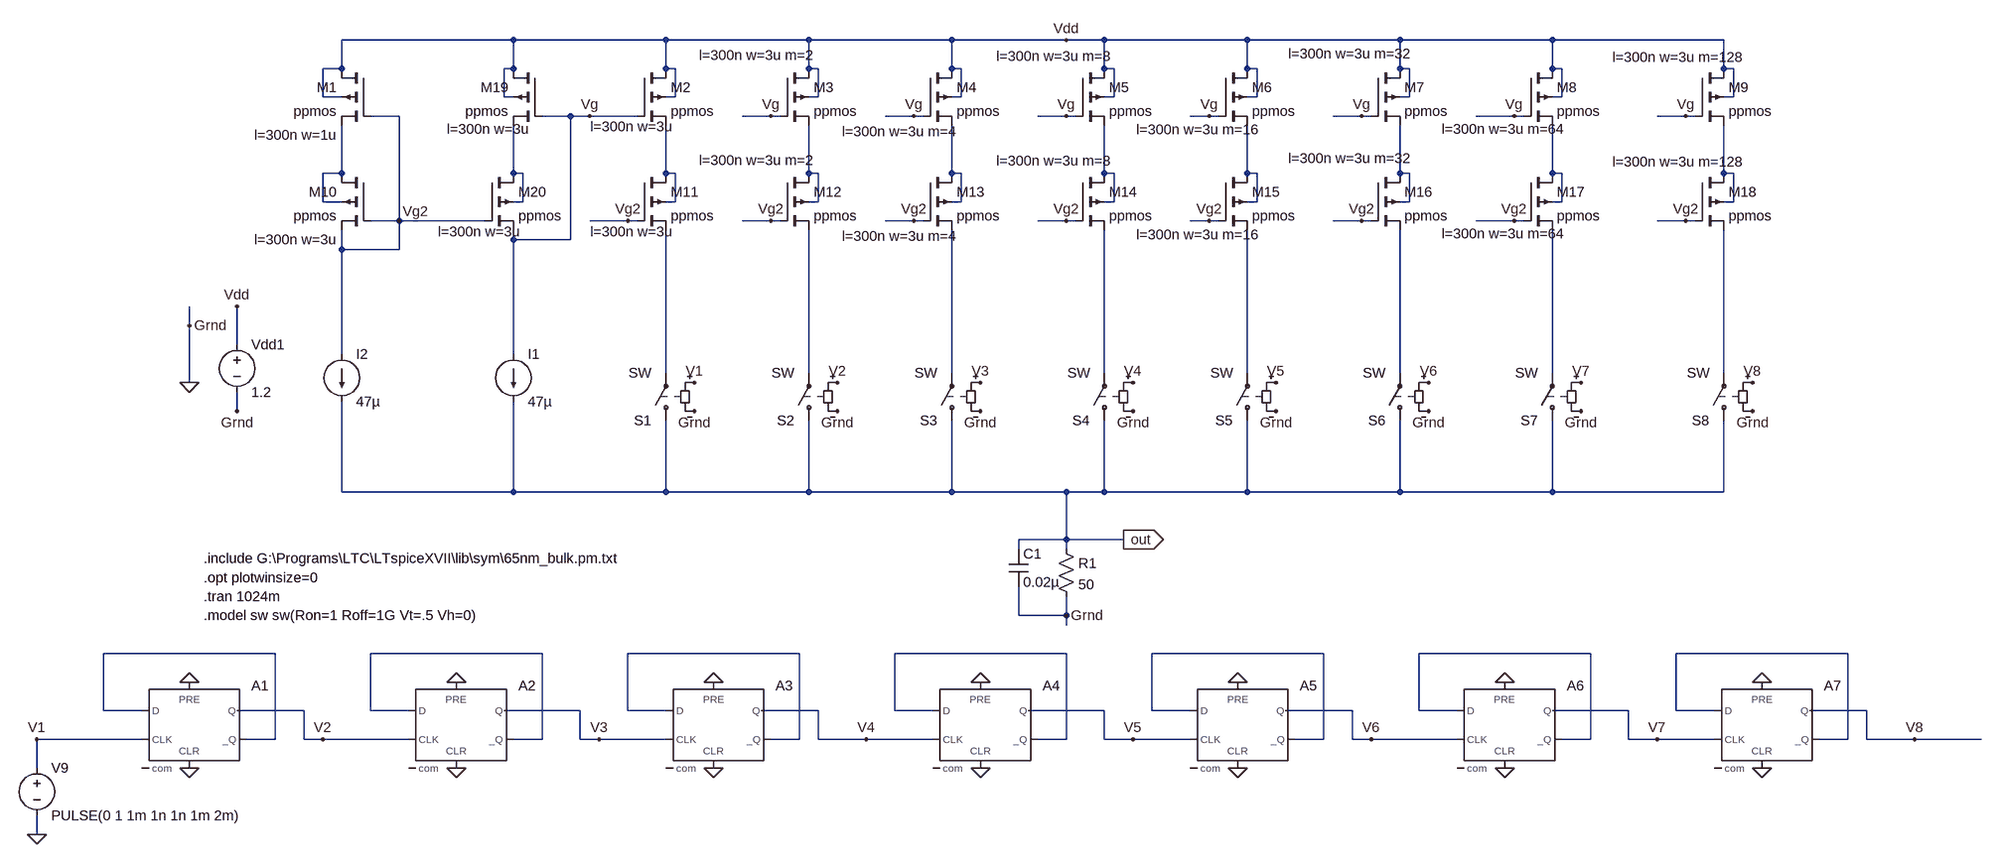
[diagram p0: schematic DAC_lv_sooch_cascode_flip_flop.asc]
DAC_lv_sooch_cascode_flip_flop.asc, the LTspice schematic file:
Version 4
SHEET 1 1952 1300
WIRE -656 -720 -944 -720
WIRE -400 -720 -656 -720
WIRE -160 -720 -400 -720
WIRE 80 -720 -160 -720
WIRE 272 -720 80 -720
WIRE 336 -720 272 -720
WIRE 576 -720 336 -720
WIRE 832 -720 576 -720
WIRE 1088 -720 832 -720
WIRE 1376 -720 1088 -720
WIRE -944 -672 -944 -720
WIRE -944 -672 -976 -672
WIRE -656 -672 -656 -720
WIRE -656 -672 -672 -672
WIRE -400 -672 -400 -720
WIRE -384 -672 -400 -672
WIRE -160 -672 -160 -720
WIRE -144 -672 -160 -672
WIRE 80 -672 80 -720
WIRE 96 -672 80 -672
WIRE 336 -672 336 -720
WIRE 352 -672 336 -672
WIRE 576 -672 576 -720
WIRE 592 -672 576 -672
WIRE 832 -672 832 -720
WIRE 848 -672 832 -672
WIRE 1088 -672 1088 -720
WIRE 1104 -672 1088 -672
WIRE 1376 -672 1376 -720
WIRE 1392 -672 1376 -672
WIRE -976 -624 -976 -672
WIRE -944 -624 -976 -624
WIRE -672 -624 -672 -672
WIRE -656 -624 -672 -624
WIRE -384 -624 -384 -672
WIRE -384 -624 -400 -624
WIRE -144 -624 -144 -672
WIRE -144 -624 -160 -624
WIRE 96 -624 96 -672
WIRE 96 -624 80 -624
WIRE 352 -624 352 -672
WIRE 352 -624 336 -624
WIRE 592 -624 592 -672
WIRE 592 -624 576 -624
WIRE 848 -624 848 -672
WIRE 848 -624 832 -624
WIRE 1104 -624 1104 -672
WIRE 1104 -624 1088 -624
WIRE 1392 -624 1392 -672
WIRE 1392 -624 1376 -624
WIRE -848 -592 -896 -592
WIRE -560 -592 -608 -592
WIRE -528 -592 -560 -592
WIRE -448 -592 -528 -592
WIRE -224 -592 -272 -592
WIRE -208 -592 -224 -592
WIRE 16 -592 -32 -592
WIRE 32 -592 16 -592
WIRE 272 -592 224 -592
WIRE 288 -592 272 -592
WIRE 512 -592 480 -592
WIRE 528 -592 512 -592
WIRE 768 -592 720 -592
WIRE 784 -592 768 -592
WIRE 1024 -592 960 -592
WIRE 1040 -592 1024 -592
WIRE 1312 -592 1264 -592
WIRE 1328 -592 1312 -592
WIRE -944 -496 -944 -576
WIRE -944 -496 -976 -496
WIRE -656 -496 -656 -576
WIRE -640 -496 -656 -496
WIRE -400 -496 -400 -576
WIRE -384 -496 -400 -496
WIRE -160 -496 -160 -576
WIRE -144 -496 -160 -496
WIRE 80 -496 80 -576
WIRE 96 -496 80 -496
WIRE 336 -496 336 -576
WIRE 352 -496 336 -496
WIRE 576 -496 576 -576
WIRE 592 -496 576 -496
WIRE 832 -496 832 -576
WIRE 848 -496 832 -496
WIRE 1088 -496 1088 -576
WIRE 1104 -496 1088 -496
WIRE 1376 -496 1376 -576
WIRE 1392 -496 1376 -496
WIRE -976 -448 -976 -496
WIRE -944 -448 -976 -448
WIRE -640 -448 -640 -496
WIRE -640 -448 -656 -448
WIRE -384 -448 -384 -496
WIRE -384 -448 -400 -448
WIRE -144 -448 -144 -496
WIRE -144 -448 -160 -448
WIRE 96 -448 96 -496
WIRE 96 -448 80 -448
WIRE 352 -448 352 -496
WIRE 352 -448 336 -448
WIRE 592 -448 592 -496
WIRE 592 -448 576 -448
WIRE 848 -448 848 -496
WIRE 848 -448 832 -448
WIRE 1104 -448 1104 -496
WIRE 1104 -448 1088 -448
WIRE 1392 -448 1392 -496
WIRE 1392 -448 1376 -448
WIRE -848 -416 -848 -592
WIRE -848 -416 -896 -416
WIRE -704 -416 -848 -416
WIRE -464 -416 -528 -416
WIRE -448 -416 -464 -416
WIRE -224 -416 -272 -416
WIRE -208 -416 -224 -416
WIRE 16 -416 -32 -416
WIRE 32 -416 16 -416
WIRE 272 -416 224 -416
WIRE 288 -416 272 -416
WIRE 512 -416 480 -416
WIRE 528 -416 512 -416
WIRE 768 -416 720 -416
WIRE 784 -416 768 -416
WIRE 1024 -416 960 -416
WIRE 1040 -416 1024 -416
WIRE 1312 -416 1264 -416
WIRE 1328 -416 1312 -416
WIRE -656 -384 -656 -400
WIRE -560 -384 -560 -592
WIRE -560 -384 -656 -384
WIRE -944 -368 -944 -400
WIRE -848 -368 -848 -416
WIRE -848 -368 -944 -368
WIRE -1200 -240 -1200 -272
WIRE -1120 -208 -1120 -272
WIRE -944 -192 -944 -368
WIRE -656 -192 -656 -384
WIRE -400 -160 -400 -400
WIRE -160 -160 -160 -400
WIRE 80 -160 80 -400
WIRE 336 -160 336 -400
WIRE 576 -160 576 -400
WIRE 832 -160 832 -400
WIRE 1088 -160 1088 -400
WIRE 1376 -160 1376 -400
WIRE -1200 -144 -1200 -240
WIRE -1120 -96 -1120 -128
WIRE -944 48 -944 -112
WIRE -656 48 -656 -112
WIRE -656 48 -944 48
WIRE -400 48 -400 -80
WIRE -400 48 -656 48
WIRE -160 48 -160 -80
WIRE -160 48 -400 48
WIRE 80 48 80 -80
WIRE 80 48 -160 48
WIRE 272 48 80 48
WIRE 336 48 336 -80
WIRE 336 48 272 48
WIRE 576 48 576 -80
WIRE 576 48 336 48
WIRE 832 48 832 -80
WIRE 832 48 576 48
WIRE 1088 48 1088 -80
WIRE 1088 48 832 48
WIRE 1376 48 1376 -80
WIRE 1376 48 1088 48
WIRE 272 128 272 48
WIRE 272 128 192 128
WIRE 368 128 272 128
WIRE 192 144 192 128
WIRE 272 144 272 128
WIRE 192 256 192 208
WIRE 272 256 272 224
WIRE 272 256 192 256
WIRE 272 272 272 256
WIRE -1056 320 -1344 320
WIRE -608 320 -896 320
WIRE -176 320 -464 320
WIRE 272 320 -16 320
WIRE 704 320 416 320
WIRE 1152 320 864 320
WIRE 1584 320 1296 320
WIRE -1344 416 -1344 320
WIRE -1280 416 -1344 416
WIRE -1008 416 -1120 416
WIRE -896 416 -896 320
WIRE -832 416 -896 416
WIRE -544 416 -672 416
WIRE -464 416 -464 320
WIRE -400 416 -464 416
WIRE -144 416 -240 416
WIRE -16 416 -16 320
WIRE 48 416 -16 416
WIRE 336 416 208 416
WIRE 416 416 416 320
WIRE 480 416 416 416
WIRE 752 416 640 416
WIRE 864 416 864 320
WIRE 928 416 864 416
WIRE 1216 416 1088 416
WIRE 1296 416 1296 320
WIRE 1360 416 1296 416
WIRE 1616 416 1520 416
WIRE -1280 464 -1456 464
WIRE -1056 464 -1056 320
WIRE -1056 464 -1104 464
WIRE -1008 464 -1008 416
WIRE -976 464 -1008 464
WIRE -832 464 -976 464
WIRE -608 464 -608 320
WIRE -608 464 -656 464
WIRE -544 464 -544 416
WIRE -512 464 -544 464
WIRE -400 464 -512 464
WIRE -176 464 -176 320
WIRE -176 464 -224 464
WIRE -144 464 -144 416
WIRE -64 464 -144 464
WIRE 48 464 -64 464
WIRE 272 464 272 320
WIRE 272 464 224 464
WIRE 336 464 336 416
WIRE 384 464 336 464
WIRE 480 464 384 464
WIRE 704 464 704 320
WIRE 704 464 656 464
WIRE 752 464 752 416
WIRE 784 464 752 464
WIRE 928 464 784 464
WIRE 1152 464 1152 320
WIRE 1152 464 1104 464
WIRE 1216 464 1216 416
WIRE 1264 464 1216 464
WIRE 1360 464 1264 464
WIRE 1584 464 1584 320
WIRE 1584 464 1536 464
WIRE 1616 464 1616 416
WIRE 1696 464 1616 464
WIRE 1808 464 1696 464
WIRE -1456 512 -1456 464
WIRE -1456 624 -1456 592
FLAG -1200 -144 0
FLAG -1120 -272 Vdd
FLAG -1200 -240 Grnd
FLAG -1120 -96 Grnd
FLAG 272 256 Grnd
FLAG -352 -96 Grnd
FLAG -112 -96 Grnd
FLAG 128 -96 Grnd
FLAG 384 -96 Grnd
FLAG 624 -96 Grnd
FLAG 880 -96 Grnd
FLAG 1136 -96 Grnd
FLAG 1424 -96 Grnd
FLAG -352 -144 V1
FLAG -112 -144 V2
FLAG 128 -144 V3
FLAG 384 -144 V4
FLAG 624 -144 V5
FLAG 880 -144 V6
FLAG 1136 -144 V7
FLAG 1424 -144 V8
FLAG 368 128 out
IOPIN 368 128 Out
FLAG 272 -720 Vdd
FLAG -528 -592 Vg
FLAG -224 -592 Vg
FLAG 16 -592 Vg
FLAG 272 -592 Vg
FLAG 512 -592 Vg
FLAG 768 -592 Vg
FLAG 1024 -592 Vg
FLAG 1312 -592 Vg
FLAG -848 -416 Vg2
FLAG -224 -416 Vg2
FLAG 16 -416 Vg2
FLAG 272 -416 Vg2
FLAG 512 -416 Vg2
FLAG 768 -416 Vg2
FLAG 1024 -416 Vg2
FLAG 1312 -416 Vg2
FLAG -464 -416 Vg2
FLAG -1456 624 0
FLAG -1200 368 0
FLAG -1200 512 0
FLAG -752 512 0
FLAG -752 368 0
FLAG -320 368 0
FLAG -320 512 0
FLAG 128 368 0
FLAG 128 512 0
FLAG 560 368 0
FLAG 560 512 0
FLAG 1008 368 0
FLAG 1008 512 0
FLAG 1440 368 0
FLAG 1440 512 0
FLAG -1456 464 V1
FLAG -976 464 V2
FLAG -512 464 V3
FLAG -64 464 V4
FLAG 384 464 V5
FLAG 784 464 V6
FLAG 1264 464 V7
FLAG 1696 464 V8
SYMBOL voltage -1120 -224 R0
WINDOW 123 0 0 Left 0
WINDOW 39 0 0 Left 0
SYMATTR InstName Vdd1
SYMATTR Value 1.2
SYMBOL current -656 -192 R0
WINDOW 123 0 0 Left 0
WINDOW 39 0 0 Left 0
SYMATTR InstName I1
SYMATTR Value 47µ
SYMBOL res 256 128 R0
SYMATTR InstName R1
SYMATTR Value 50
SYMBOL sw -400 -64 R180
SYMATTR InstName S1
SYMBOL sw -160 -64 R180
SYMATTR InstName S2
SYMBOL sw 80 -64 R180
SYMATTR InstName S3
SYMBOL sw 336 -64 R180
SYMATTR InstName S4
SYMBOL sw 576 -64 R180
SYMATTR InstName S5
SYMBOL sw 832 -64 R180
SYMATTR InstName S6
SYMBOL sw 1088 -64 R180
SYMATTR InstName S7
SYMBOL sw 1376 -64 R180
SYMATTR InstName S8
SYMBOL pmos4 -896 -672 M0
WINDOW 123 56 112 Left 2
SYMATTR Value2 l=300n w=1u
SYMATTR InstName M1
SYMATTR Value ppmos
SYMBOL pmos4 -448 -672 R0
WINDOW 123 -79 98 Left 2
SYMATTR Value2 l=300n w=3u
SYMATTR InstName M2
SYMATTR Value ppmos
SYMBOL pmos4 -208 -672 R0
WINDOW 123 -136 -22 Left 2
SYMATTR Value2 l=300n w=3u m=2
SYMATTR InstName M3
SYMATTR Value ppmos
SYMBOL pmos4 32 -672 R0
WINDOW 123 -136 106 Left 2
SYMATTR Value2 l=300n w=3u m=4
SYMATTR InstName M4
SYMATTR Value ppmos
SYMBOL pmos4 288 -672 R0
WINDOW 123 -133 -21 Left 2
SYMATTR Value2 l=300n w=3u m=8
SYMATTR InstName M5
SYMATTR Value ppmos
SYMBOL pmos4 528 -672 R0
WINDOW 123 -138 103 Left 2
SYMATTR Value2 l=300n w=3u m=16
SYMATTR InstName M6
SYMATTR Value ppmos
SYMBOL pmos4 784 -672 R0
WINDOW 123 -139 -25 Left 2
SYMATTR Value2 l=300n w=3u m=32
SYMATTR InstName M7
SYMATTR Value ppmos
SYMBOL pmos4 1040 -672 R0
WINDOW 123 -138 102 Left 2
SYMATTR Value2 l=300n w=3u m=64
SYMATTR InstName M8
SYMATTR Value ppmos
SYMBOL pmos4 1328 -672 R0
WINDOW 123 -139 -19 Left 2
SYMATTR Value2 l=300n w=3u m=128
SYMATTR InstName M9
SYMATTR Value ppmos
SYMBOL pmos4 -896 -496 M0
WINDOW 123 56 112 Left 2
SYMATTR Value2 l=300n w=3u
SYMATTR InstName M10
SYMATTR Value ppmos
SYMBOL pmos4 -448 -496 R0
WINDOW 123 -79 98 Left 2
SYMATTR Value2 l=300n w=3u
SYMATTR InstName M11
SYMATTR Value ppmos
SYMBOL pmos4 -208 -496 R0
WINDOW 123 -136 -22 Left 2
SYMATTR Value2 l=300n w=3u m=2
SYMATTR InstName M12
SYMATTR Value ppmos
SYMBOL pmos4 32 -496 R0
WINDOW 123 -136 106 Left 2
SYMATTR Value2 l=300n w=3u m=4
SYMATTR InstName M13
SYMATTR Value ppmos
SYMBOL pmos4 288 -496 R0
WINDOW 123 -133 -21 Left 2
SYMATTR Value2 l=300n w=3u m=8
SYMATTR InstName M14
SYMATTR Value ppmos
SYMBOL pmos4 528 -496 R0
WINDOW 123 -138 103 Left 2
SYMATTR Value2 l=300n w=3u m=16
SYMATTR InstName M15
SYMATTR Value ppmos
SYMBOL pmos4 784 -496 R0
WINDOW 123 -139 -25 Left 2
SYMATTR Value2 l=300n w=3u m=32
SYMATTR InstName M16
SYMATTR Value ppmos
SYMBOL pmos4 1040 -496 R0
WINDOW 123 -138 102 Left 2
SYMATTR Value2 l=300n w=3u m=64
SYMATTR InstName M17
SYMATTR Value ppmos
SYMBOL pmos4 1328 -496 R0
WINDOW 123 -139 -19 Left 2
SYMATTR Value2 l=300n w=3u m=128
SYMATTR InstName M18
SYMATTR Value ppmos
SYMBOL cap 176 144 R0
SYMATTR InstName C1
SYMATTR Value 0.02µ
SYMBOL pmos4 -608 -672 M0
WINDOW 123 21 102 Left 2
SYMATTR Value2 l=300n w=3u
SYMATTR InstName M19
SYMATTR Value ppmos
SYMBOL pmos4 -704 -496 R0
WINDOW 123 -79 98 Left 2
SYMATTR Value2 l=300n w=3u
SYMATTR InstName M20
SYMATTR Value ppmos
SYMBOL current -944 -192 R0
WINDOW 123 0 0 Left 0
WINDOW 39 0 0 Left 0
SYMATTR InstName I2
SYMATTR Value 47µ
SYMBOL Digital\\dflop -1200 368 R0
SYMATTR InstName A1
SYMBOL Digital\\dflop -752 368 R0
SYMATTR InstName A2
SYMBOL Digital\\dflop -320 368 R0
SYMATTR InstName A3
SYMBOL Digital\\dflop 128 368 R0
SYMATTR InstName A4
SYMBOL Digital\\dflop 560 368 R0
SYMATTR InstName A5
SYMBOL Digital\\dflop 1008 368 R0
SYMATTR InstName A6
SYMBOL Digital\\dflop 1440 368 R0
SYMATTR InstName A7
SYMBOL voltage -1456 496 R0
WINDOW 123 0 0 Left 0
WINDOW 39 0 0 Left 0
SYMATTR InstName V9
SYMATTR Value PULSE(0 1 1m 1n 1n 1m 2m)
TEXT -1176 160 Left 2 !.include G:\\Programs\\LTC\\LTspiceXVII\\lib\\sym\\65nm_bulk.pm.txt
TEXT -1176 192 Left 2 !.opt plotwinsize=0
TEXT -1176 224 Left 2 !.tran 1024m
TEXT -1176 256 Left 2 !.model sw sw(Ron=1 Roff=1G Vt=.5 Vh=0)

The netlist it stands for:
* DAC_lv_sooch_cascode_flip_flop.asc
Vdd1 Vdd 0 1.2
I1 Vg out 47µ
R1 out 0 50
S1 out N011 V1 0 SW
S2 out N012 V2 0 SW
S3 out N013 V3 0 SW
S4 out N014 V4 0 SW
S5 out N015 V5 0 SW
S6 out N016 V6 0 SW
S7 out N017 V7 0 SW
S8 out N018 V8 0 SW
M1 Vdd Vg2 N001 Vdd ppmos l=300n w=1u
M2 Vdd Vg N003 Vdd ppmos l=300n w=3u
M3 Vdd Vg N004 Vdd ppmos l=300n w=3u m=2
M4 Vdd Vg N005 Vdd ppmos l=300n w=3u m=4
M5 Vdd Vg N006 Vdd ppmos l=300n w=3u m=8
M6 Vdd Vg N007 Vdd ppmos l=300n w=3u m=16
M7 Vdd Vg N008 Vdd ppmos l=300n w=3u m=32
M8 Vdd Vg N009 Vdd ppmos l=300n w=3u m=64
M9 Vdd Vg N010 Vdd ppmos l=300n w=3u m=128
M10 N001 Vg2 Vg2 N001 ppmos l=300n w=3u
M11 N003 Vg2 N011 N003 ppmos l=300n w=3u
M12 N004 Vg2 N012 N004 ppmos l=300n w=3u m=2
M13 N005 Vg2 N013 N005 ppmos l=300n w=3u m=4
M14 N006 Vg2 N014 N006 ppmos l=300n w=3u m=8
M15 N007 Vg2 N015 N007 ppmos l=300n w=3u m=16
M16 N008 Vg2 N016 N008 ppmos l=300n w=3u m=32
M17 N009 Vg2 N017 N009 ppmos l=300n w=3u m=64
M18 N010 Vg2 N018 N010 ppmos l=300n w=3u m=128
C1 out 0 0.02µ
M19 Vdd Vg N002 Vdd ppmos l=300n w=3u
M20 N002 Vg2 Vg N002 ppmos l=300n w=3u
I2 Vg2 out 47µ
A1 N019 0 V1 0 0 N019 V2 0 DFLOP
A2 N020 0 V2 0 0 N020 V3 0 DFLOP
A3 N021 0 V3 0 0 N021 V4 0 DFLOP
A4 N022 0 V4 0 0 N022 V5 0 DFLOP
A5 N023 0 V5 0 0 N023 V6 0 DFLOP
A6 N024 0 V6 0 0 N024 V7 0 DFLOP
A7 N025 0 V7 0 0 N025 V8 0 DFLOP
V9 V1 0 PULSE(0 1 1m 1n 1n 1m 2m)
.model NMOS NMOS
.model PMOS PMOS
.lib standard.mos
.include G:\Programs\LTC\LTspiceXVII\lib\sym\65nm_bulk.pm.txt
.opt plotwinsize=0
.tran 1024m
.model sw sw(Ron=1 Roff=1G Vt=.5 Vh=0)
.backanno
.end